# EAGLE design HbSizeMCircuit (EAGLE 8.7.0)

## Sheet 1 of 7: Power Supply
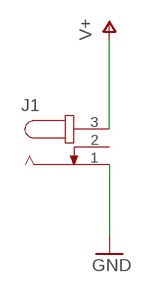
[diagram p0: schematic, sheet 1]

### Parts
J1  JACK-PLUG1  [SPC4078]

### Nets
GND: J1.1 ; also sheet 2,3,4,5,6,7
V+: J1.3 ; also sheet 3
Unconnected: J1.2

## Sheet 2 of 7: Power Switch
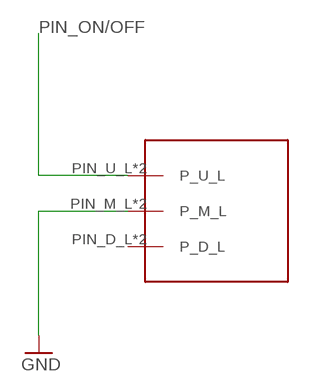
[diagram p1: schematic, sheet 2]

### Parts
U$2  IS-1250_POWERSWITCH  [IS-1250_POWERSWITCH]

### Nets
GND: U$2.PIN_M_L(P_M_L) U$2.PIN_M_R(P_M_L) ; also sheet 1,3,4,5,6,7
PIN_ON/OFF: U$2.PIN_U_L(P_U_L) U$2.PIN_U_R(P_U_L) ; also sheet 3
Unconnected: U$2.PIN_D_L(P_D_L) U$2.PIN_D_R(P_D_L)

## Sheet 3 of 7: DC-DC Converter
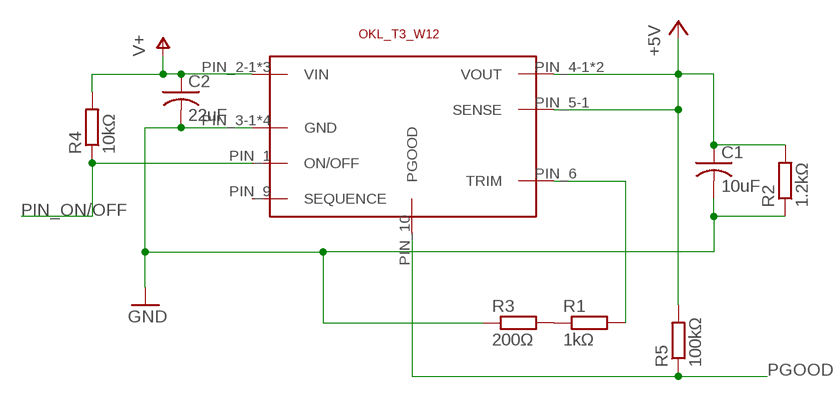
[diagram p2: schematic, sheet 3]

### Parts
C1  10uF  C-USC1206  [C1206]
C2  22uF  C-USC1206  [C1206]
R1  1kΩ  R-EU_M1206  [M1206]
R2  1.2kΩ  R-EU_M1206  [M1206]
R3  200Ω  R-EU_M1206  [M1206]
R4  10kΩ  R-EU_R1206  [R1206]
R5  100kΩ  R-EU_M1206  [M1206]
U$8  OKL_T3_W12  [OKL_T3_W12]

### Nets
+5V: C1.1 R2.2 R5.2 U$8.PIN_4-1(VOUT) U$8.PIN_4-2(VOUT) U$8.PIN_5-1(SENSE) ; also sheet 5,6,7
GND: C1.2 C2.2 R2.1 R3.1 U$8.PIN_3-1(GND) U$8.PIN_3-2(GND) U$8.PIN_3-3(GND) U$8.PIN_7(GND) ; also sheet 1,2,4,5,6,7
N$1: R1.2 U$8.PIN_6(TRIM)
N$2: R1.1 R3.2
PGOOD: R5.1 U$8.PIN_10(PGOOD) ; also sheet 6
PIN_ON/OFF: R4.1 U$8.PIN_1(ON/OFF) ; also sheet 2
V+: C2.1 R4.2 U$8.PIN_2-1(VIN) U$8.PIN_2-2(VIN) U$8.PIN_2-3(VIN) ; also sheet 1
Unconnected: U$8.PIN_9(SEQUENCE)

## Sheet 4 of 7: Buttons
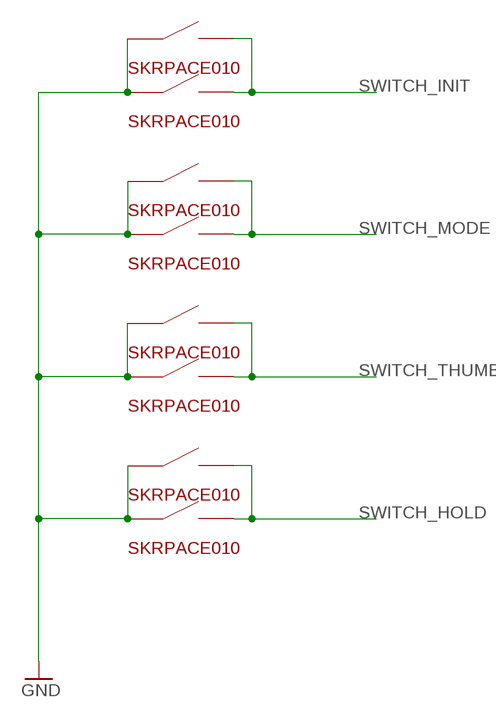
[diagram p3: schematic, sheet 4]

### Parts
U$1  SKRPACE010  [SKRPACE010]
U$3  SKRPACE010  [SKRPACE010]
U$4  SKRPACE010  [SKRPACE010]
U$5  SKRPACE010  [SKRPACE010]
U$12  SKRPACE010  [SKRPACE010]
U$13  SKRPACE010  [SKRPACE010]
U$14  SKRPACE010  [SKRPACE010]
U$15  SKRPACE010  [SKRPACE010]

### Nets
GND: U$1.PINA_LEFT(A_LEFT) U$1.PINA_RIGHT(A_LEFT) U$3.PINA_LEFT(A_LEFT) U$3.PINA_RIGHT(A_LEFT) U$4.PINA_LEFT(A_LEFT) U$4.PINA_RIGHT(A_LEFT) U$5.PINA_LEFT(A_LEFT) U$5.PINA_RIGHT(A_LEFT) U$12.PINA_LEFT(A_LEFT) U$12.PINA_RIGHT(A_LEFT) U$13.PINA_LEFT(A_LEFT) U$13.PINA_RIGHT(A_LEFT) U$14.PINA_LEFT(A_LEFT) U$14.PINA_RIGHT(A_LEFT) U$15.PINA_LEFT(A_LEFT) U$15.PINA_RIGHT(A_LEFT) ; also sheet 1,2,3,5,6,7
SWITCH_HOLD: U$12.PINB_LEFT(B_LEFT) U$12.PINB_RIGHT(B_LEFT) U$15.PINB_LEFT(B_LEFT) U$15.PINB_RIGHT(B_LEFT) ; also sheet 6
SWITCH_INIT: U$1.PINB_LEFT(B_LEFT) U$1.PINB_RIGHT(B_LEFT) U$5.PINB_LEFT(B_LEFT) U$5.PINB_RIGHT(B_LEFT) ; also sheet 6
SWITCH_MODE: U$3.PINB_LEFT(B_LEFT) U$3.PINB_RIGHT(B_LEFT) U$13.PINB_LEFT(B_LEFT) U$13.PINB_RIGHT(B_LEFT) ; also sheet 6
SWITCH_THUMB: U$4.PINB_LEFT(B_LEFT) U$4.PINB_RIGHT(B_LEFT) U$14.PINB_LEFT(B_LEFT) U$14.PINB_RIGHT(B_LEFT) ; also sheet 6

## Sheet 5 of 7: ServoMotor
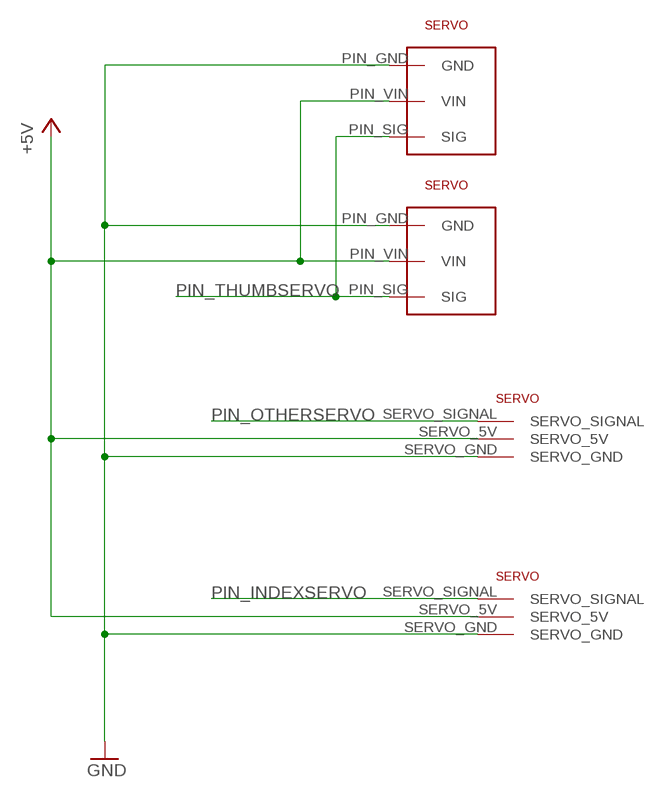
[diagram p4: schematic, sheet 5]

### Parts
U$7  NN_SERVO  [NN_SERVO]
U$9  53398-0371  [53398-0371]
U$11  NN_SERVO  [NN_SERVO]
U$16  53398-0371  [53398-0371]

### Nets
+5V: U$7.SERVO_5V U$9.PIN_VIN(VIN) U$11.SERVO_5V U$16.PIN_VIN(VIN) ; also sheet 3,6,7
GND: U$7.SERVO_GND U$9.PIN_GND(GND) U$11.SERVO_GND U$16.PIN_GND(GND) ; also sheet 1,2,3,4,6,7
PIN_INDEXSERVO: U$11.SERVO_SIGNAL ; also sheet 6
PIN_OTHERSERVO: U$7.SERVO_SIGNAL ; also sheet 6
PIN_THUMBSERVO: U$9.PIN_SIG(SIG) U$16.PIN_SIG(SIG) ; also sheet 6

## Sheet 6 of 7: CPU
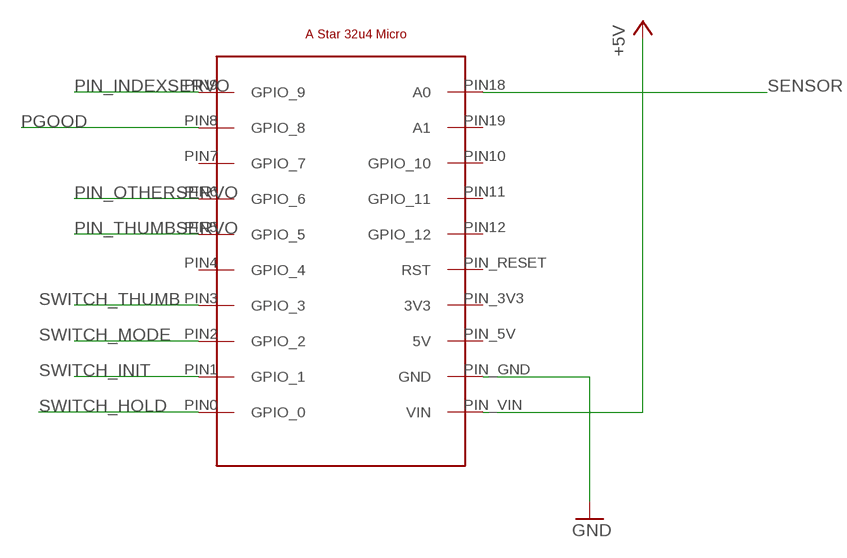
[diagram p5: schematic, sheet 6]

### Parts
U$6  POLOLU_A_STAR_32U4_MICRO_SMD  [POLOLU_A_STAR_32U4_MICRO_SMD]

### Nets
+5V: U$6.PIN_VIN(VIN) ; also sheet 3,5,7
GND: U$6.PIN_GND(GND) ; also sheet 1,2,3,4,5,7
PGOOD: U$6.PIN8(GPIO_8) ; also sheet 3
PIN_INDEXSERVO: U$6.PIN9(GPIO_9) ; also sheet 5
PIN_OTHERSERVO: U$6.PIN6(GPIO_6) ; also sheet 5
PIN_THUMBSERVO: U$6.PIN5(GPIO_5) ; also sheet 5
SENSOR: U$6.PIN18(A0) ; also sheet 7
SWITCH_HOLD: U$6.PIN0(GPIO_0) ; also sheet 4
SWITCH_INIT: U$6.PIN1(GPIO_1) ; also sheet 4
SWITCH_MODE: U$6.PIN2(GPIO_2) ; also sheet 4
SWITCH_THUMB: U$6.PIN3(GPIO_3) ; also sheet 4
Unconnected: U$6.PIN4(GPIO_4) U$6.PIN7(GPIO_7) U$6.PIN10(GPIO_10) U$6.PIN11(GPIO_11) U$6.PIN12(GPIO_12) U$6.PIN19(A1) U$6.PIN_3V3(3V3) U$6.PIN_5V(5V) U$6.PIN_RESET(RST)

## Sheet 7 of 7: Sensor
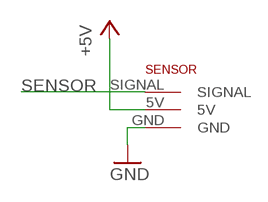
[diagram p6: schematic, sheet 7]

### Parts
U$10  NN_SENSOR  [NN_SENSOR]

### Nets
+5V: U$10.5V ; also sheet 3,5,6
GND: U$10.GND ; also sheet 1,2,3,4,5,6
SENSOR: U$10.SIGNAL ; also sheet 6

## Library data of the parts
C1 C2 = resistor:C-US: CAPACITOR, American symbol
J1 = HbSizeM:JACK-PLUG: DC POWER JACK Power Jack, DC, Right Angle, Through Hole, Rated 5A at 16VDC, PC Terminals Distributor: Farnell (www.Farnell.de) Drawing: 84N1161.pdf / 84N1162.pdf Manufacturer: SPC Technology (www.spctechnology.com) Type: SPC4077 / SPC 4078
R1-R5 = resistor:R-EU_: RESISTOR, European symbol
U$1 U$3-U$5 U$12-U$15 = HbSizeM:SKRPACE010
U$2 = HbHandBoard_SizeS:IS-1250_POWERSWITCH
U$6 = HbHandBoard_SizeS:POLOLU_A_STAR_32U4_MICRO_SMD
U$7 U$11 = HbSizeM:NN_SERVO
U$8 = HbHandBoard_SizeS:OKL_T3_W12
U$9 U$16 = HbHandBoard_SizeS:53398-0371
U$10 = HbSizeM:NN_SENSOR

## Board
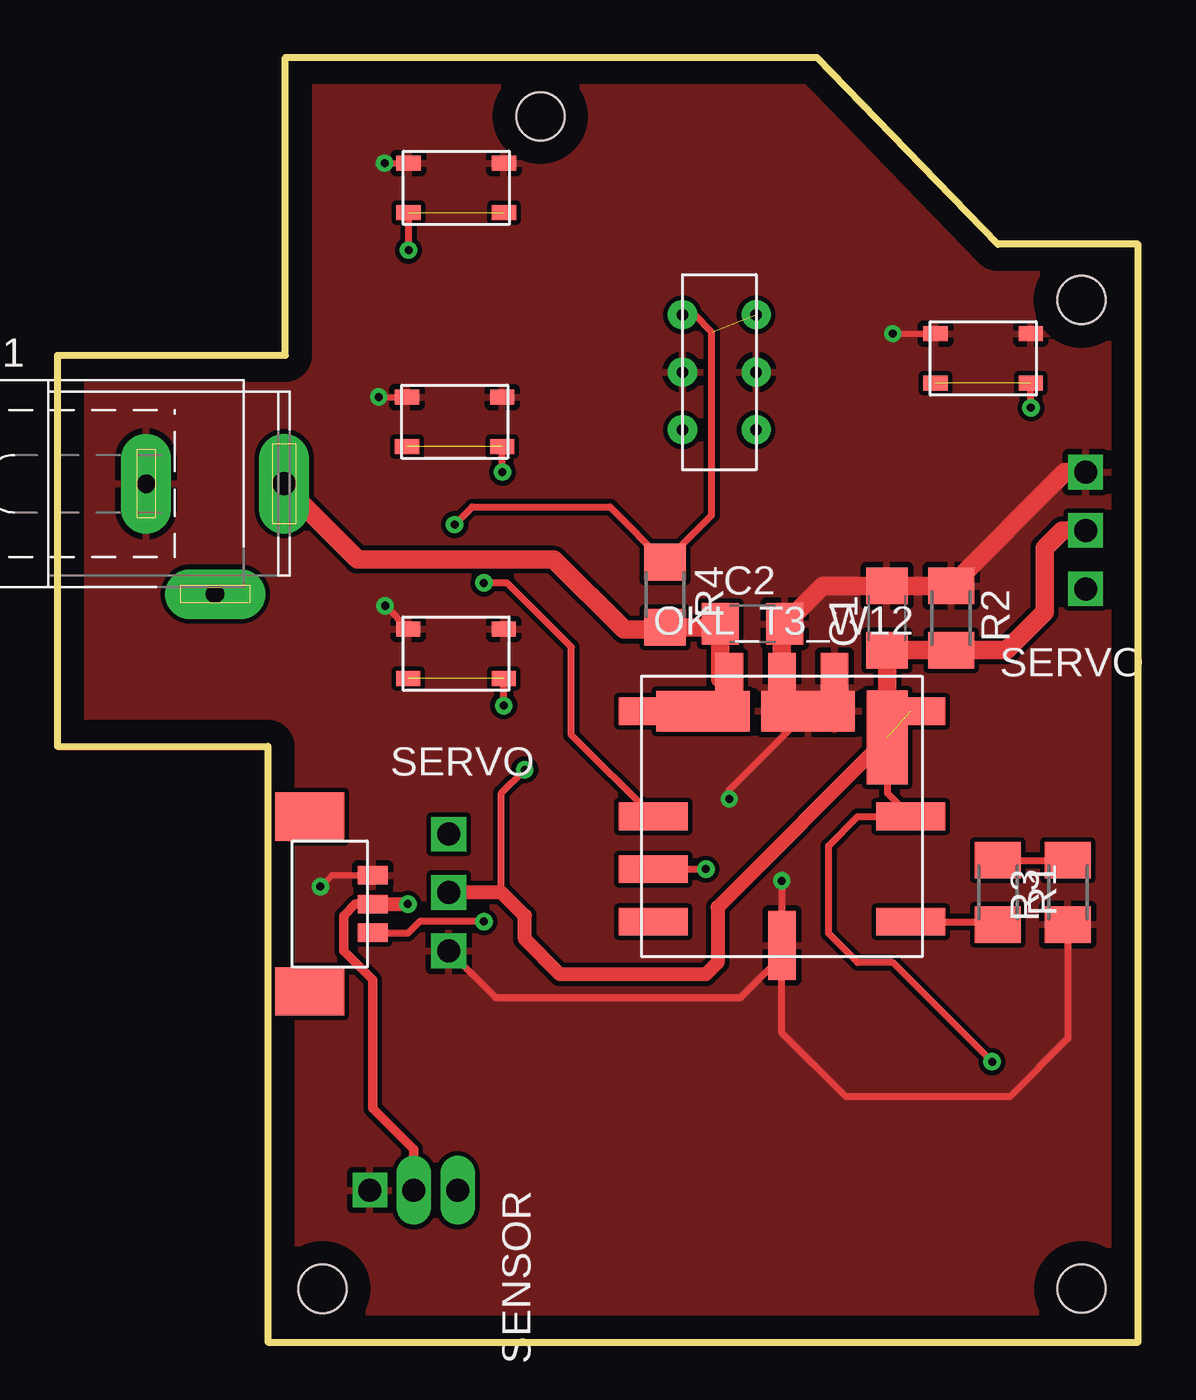
[diagram p7: board, top side]
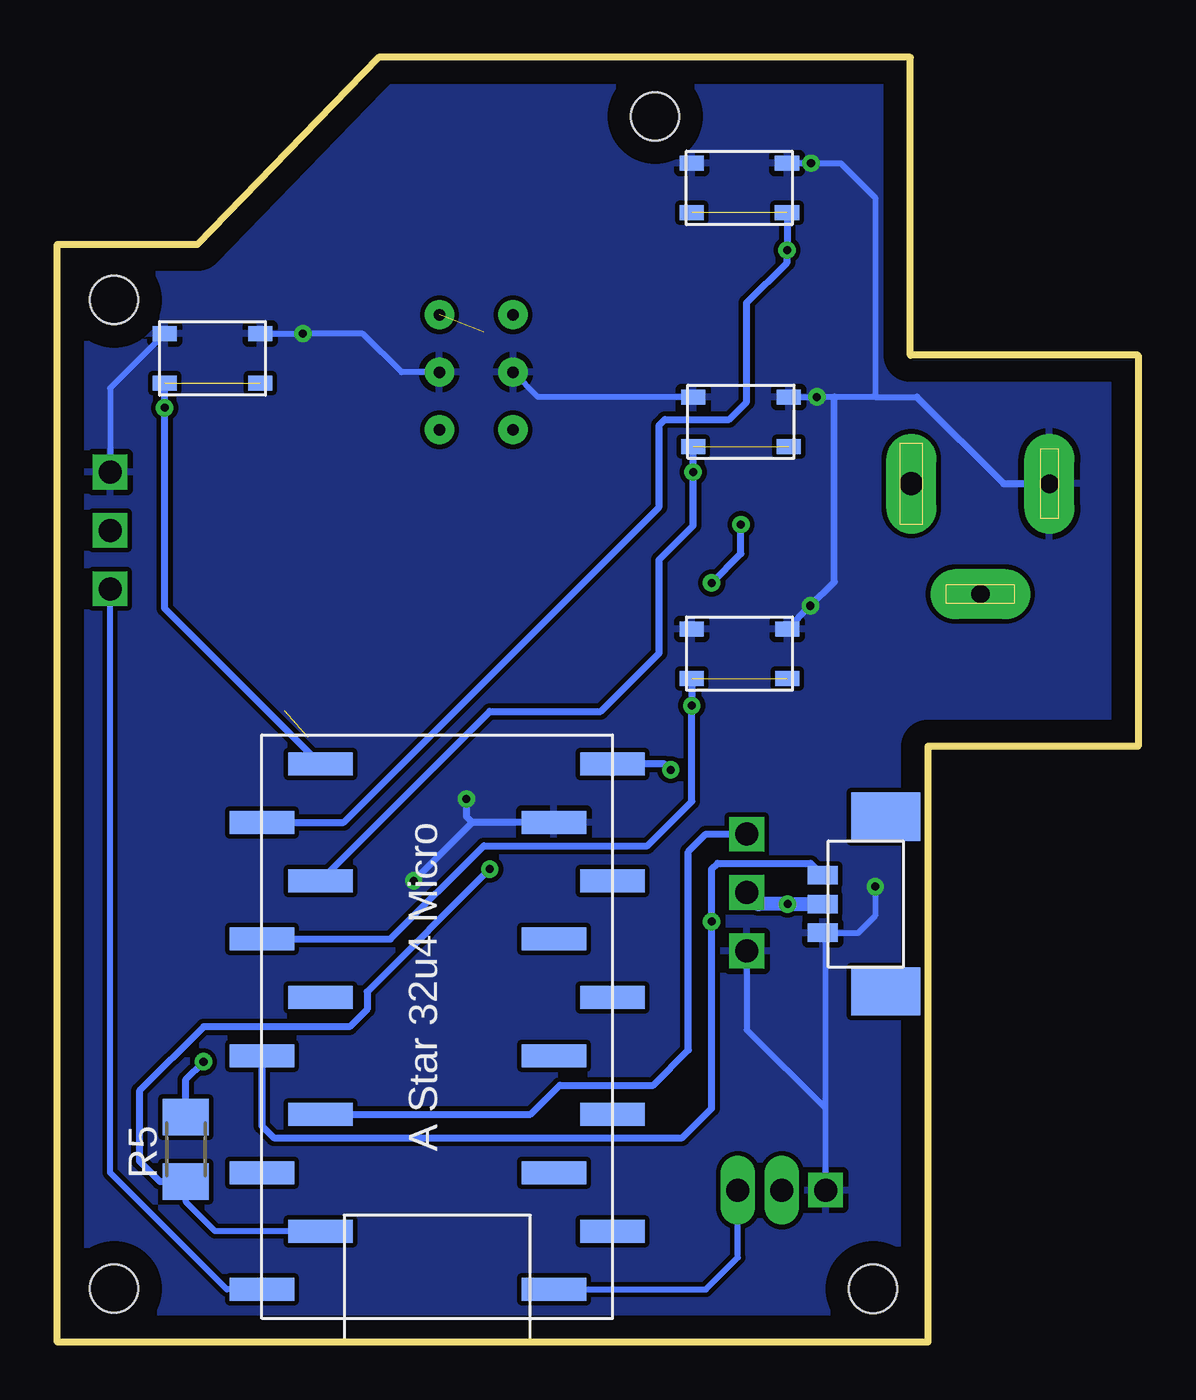
[diagram p8: board, bottom side, seen from below]

Size 46.99 x 55.88 mm. Coordinates in mm from the lower left corner, seen from the top.
Outline: 0,42.93 9.91,42.93 9.91,55.88 33.02,55.88 40.89,47.75 46.99,47.75 46.99,0 9.14,0 9.14,25.91 0,25.91 0,42.93
Copper layers (1*16): Top 0.035mm / dielectric 1.5mm / Bottom 0.035mm
Design rules "default *": minimum track width 6mil, minimum drill 0.35mm, track to track 8mil, track to pad 8mil, pad to pad 8mil, via to via 8mil, smd to smd 8mil, copper to edge 40mil, drill to drill 6mil, minimum pad ring 10mil, minimum via ring 8mil, stop-mask expansion 4mil, vias tented up to drill 0mil, thermal gap 10mil
Holes 2.1 mm at 21,53.32 44.53,45.33 44.53,2.32 11.52,2.32

### Footprints (pad centres in the part's own frame; a part is rotated, then mirrored left to right if it is on the bottom)
C1206 = smd 1.6 x 1.8: 1 -1.4,0; 2 1.4,0
SPC4078 = drill 0.8 pad 2.184 long: 1 -3,0; 2 0,-4.8 | drill 1 pad 2.184 long: 3 3,0
M1206 = smd 1.6 x 2: 1 -1.4,0; 2 1.4,0
R1206 = smd 1.6 x 1.803: 1 -1.422,0; 2 1.422,0
SKRPACE010 = smd 1.05 x 0.65: PINA_LEFT -2.075,1.075; PINA_RIGHT 2.075,1.075; PINB_LEFT -2.075,-1.075; PINB_RIGHT 2.075,-1.075
IS-1250_POWERSWITCH = drill 0.5 pad 1.27: PIN_D_L -1.6,-2.5; PIN_D_R 1.6,-2.5; PIN_M_L -1.6,0; PIN_M_R 1.6,0; PIN_U_L -1.6,2.5; PIN_U_R 1.6,2.5
POLOLU_A_STAR_32U4_MICRO_SMD = smd 2.801 x 1: PIN0 5.08,-11.43; PIN1 7.62,-8.89; PIN2 5.08,-6.35; PIN3 7.62,-3.81; PIN4 5.08,-1.27; PIN5 7.62,1.27; PIN6 5.08,3.81; PIN7 7.62,6.35; PIN8 5.08,8.89; PIN9 7.62,11.43; PIN10 -5.08,6.35; PIN11 -7.62,3.81; PIN12 -5.08,1.27; PIN18 -5.08,11.43; PIN19 -7.62,8.89; PIN_3V3 -5.08,-3.81; PIN_5V -7.62,-6.35; PIN_GND -5.08,-8.89; PIN_RESET -7.62,-1.27; PIN_VIN -7.62,-11.43
NN_SERVO = drill 1 square: SERVO_5V 0,0; SERVO_GND 0,-2.54; SERVO_SIGNAL 0,2.54
OKL_T3_W12 = smd 3 x 1.2: PIN_1 0.5,6.1; PIN_2-1 0.5,10.68; PIN_4-1 11.7,10.68; PIN_5-1 11.7,6.1; PIN_6 11.7,1.52; PIN_9 0.5,1.52; PIN_10 0.5,3.81 | smd 4.07 x 1.77: PIN_2-2 2.665,10.68; PIN_3-2 7.245,10.68 | smd 1.2 x 3: PIN_2-3 3.81,11.7; PIN_3-1 6.1,11.7; PIN_3-3 8.39,11.7; PIN_7 6.1,0.5 | smd 1.77 x 4.07: PIN_4-2 10.685,9.535
53398-0371 = smd 2.1 x 3: P$4 3.8,-2.75; P$5 -3.8,-2.75 | smd 0.8 x 1.3: PIN_GND -1.25,0; PIN_SIG 1.25,0; PIN_VIN 0,0
NN_SENSOR = drill 1 long: 5V 0,0; SIGNAL 0,1.905 | drill 1 square: GND 0,-1.905

### Placement (x,y rotation side)
C1  36.07,31.5 90 top
C2  30.23,31.24 0 top
J1  6.86,37.34 0 top
R1  40.89,19.56 270 top
R2  38.86,31.5 270 top
R3  43.94,19.56 90 top
R4  26.42,32.51 270 top
R5  41.4,8.38 90 bottom
U$1  17.34,50.21 0 bottom
U$2  28.78,42.19 0 top
U$3  17.27,40.04 0 top
U$4  17.33,29.94 0 top
U$5  17.34,50.21 0 top
U$6  30.48,13.72 180 bottom
U$7  17.02,19.56 0 top
U$8  25.4,16.76 0 top
U$9  13.72,19.05 90 bottom
U$10  15.49,6.6 270 top
U$11  44.7,35.31 180 top
U$12  40.25,42.79 0 top
U$13  17.27,40.04 0 bottom
U$14  17.33,29.94 0 bottom
U$15  40.25,42.79 0 bottom
U$16  13.72,19.05 270 top

### Tracks (layer width: path | path; a pad name or v marks a point on that pad's centre or on a via)
+5V  (via drill 0.35)  (1 unrouted)
  Top 0.305: 19.3,19.56 19.3,23.88 v20.32,24.89 | v40.64,12.19 36.32,16.51 34.8,16.51 33.53,17.78 33.53,21.59 34.8,22.86 U$8.PIN_5-1 36.09,23.88 U$8.PIN_4-2
  Top 0.406: U$16.PIN_VIN 12.95,19.05 12.45,18.54 12.45,17.02 13.72,15.75 13.72,10.16 15.49,8.38 U$10.5V
  Top 0.61: U$16.PIN_VIN v15.24,19.05 | U$8.PIN_4-2 28.7,18.92 28.7,16.51 28.19,16 21.84,16 20.32,17.53 20.32,18.54 19.3,19.56 U$7.SERVO_5V
  Top 0.813: U$8.PIN_4-2 36.09,30.08 C1.1 R2.2 41.27,30.1 42.93,31.75 42.93,34.54 43.69,35.31 U$11.SERVO_5V
  Bottom 0.305: v20.32,24.89 20.57,25.15 U$6.PIN_VIN | R5.2 41.4,11.43 v40.64,12.19
  Bottom 0.61: U$7.SERVO_5V 16.51,19.05 v15.24,19.05 U$16.PIN_VIN
GND  (via drill 0.35)
  Top 0.254: v36.32,43.87 U$15.PINA_RIGHT | v14.22,51.28 U$1.PINA_RIGHT U$5.PINA_LEFT | v13.97,41.11 U$13.PINA_RIGHT | U$13.PINA_RIGHT | U$16.PIN_GND 11.92,20.3 v11.43,19.81
  Top 0.305: U$7.SERVO_GND 19.05,14.99 29.72,14.99 31.5,16.77 | 31.5,16.77 U$8.PIN_7 v31.5,20.06 v31.5,20.07 | v14.25,32.03 U$14.PINA_RIGHT | U$8.PIN_3-2 29.21,24.01 v29.21,23.62 | U$8.PIN_3-1 32.52,27.44 U$8.PIN_3-2 | U$8.PIN_3-2 33.66,28.46 U$8.PIN_3-3 | R3.1 43.94,13.21 41.4,10.67 34.29,10.67 31.5,13.46 31.5,16.77
  Top 0.813: U$8.PIN_3-1 31.5,31.12 C2.2 33.28,32.9 C1.2 R2.1 43.81,37.85 U$11.SERVO_GND
  Bottom 0.254: 11.43,41.11 9.61,41.11 | 11.43,41.11 13.21,41.11 v13.97,41.11 U$13.PINA_RIGHT | 11.43,41.11 11.43,49.78 12.93,51.28 v14.22,51.28 U$1.PINA_RIGHT | U$13.PINA_LEFT 26.1,41.11 U$2.PIN_M_L | U$2.PIN_M_R 32.03,42.19 33.71,43.87 v36.32,43.87 U$15.PINA_RIGHT | U$15.PINA_LEFT 44.7,41.49 U$11.SERVO_GND | U$10.GND 13.59,10.16 | 13.59,10.16 13.59,17.67 U$9.PIN_GND 13.7,17.78 12.19,17.78 11.43,18.54 v11.43,19.81 | U$7.SERVO_GND 17.02,13.59 13.59,10.16
  Bottom 0.305: U$6.PIN_GND 28.96,22.61 | 28.96,22.61 v31.5,20.07 | U$14.PINA_RIGHT v14.25,32.03 13.21,33.07 13.21,41.11 | v29.21,23.62 29.21,22.86 28.96,22.61 | 9.61,41.11 5.84,37.34 J1.1
  pour Top: 0,42.93 9.91,42.93 9.91,55.88 33.02,55.88 40.89,47.75 46.99,47.75 46.99,0 9.14,0 9.14,25.91 0,25.91
  pour Bottom: 0,42.93 0,25.91 9.14,25.91 9.14,0 46.99,0 46.99,47.75 40.89,47.75 33.02,55.88 9.91,55.88 9.91,42.93
N$1
  Top 0.305: U$8.PIN_6 40.77,18.28 R1.2
N$2
  Top 0.305: R1.1 R3.2
PGOOD  (via drill 0.35)
  Top 0.305: U$8.PIN_10 v28.19,20.57
  Bottom 0.254: U$6.PIN8 40.13,4.83 41.4,6.1 R5.1
  Bottom 0.305: v28.19,20.57 33.53,15.24 33.53,14.48 34.29,13.72 40.64,13.72 43.43,10.92 43.43,7.87 42.54,6.98 R5.1
PIN_INDEXSERVO
  Bottom 0.254: U$6.PIN9 39.62,2.29 44.7,7.37 U$11.SERVO_SIGNAL
PIN_ON/OFF  (via drill 0.35)  (1 unrouted)
  Top 0.305: U$2.PIN_U_L 27.7,44.69 28.45,43.94 28.45,35.97 R4.1 24.03,36.32 18.03,36.32 v17.27,35.56 | U$8.PIN_1 22.35,26.41 22.35,30.23 19.56,33.02 v18.54,33.02
  Bottom 0.305: v18.54,33.02 17.27,34.29 v17.27,35.56
PIN_OTHERSERVO
  Bottom 0.305: U$6.PIN6 26.42,9.91 25.15,11.18 21.08,11.18 19.56,12.7 19.56,21.34 18.8,22.1 U$7.SERVO_SIGNAL
PIN_THUMBSERVO  (via drill 0.35)
  Top 0.305: v18.54,18.29 15.75,18.29 15.24,17.78 13.74,17.78 U$16.PIN_SIG
  Bottom 0.305: U$6.PIN5 38.1,9.4 37.59,8.89 19.81,8.89 18.54,10.16 v18.54,18.29 18.54,20.57 18.29,20.83 14.24,20.83 U$9.PIN_SIG
SENSOR
  Bottom 0.254: U$6.PIN18 18.8,2.29 17.4,3.68 U$10.SIGNAL
SWITCH_HOLD  (via drill 0.35)  (2 unrouted)
  Top 0.305: v42.33,40.64 U$12.PINB_RIGHT | U$12.PINB_RIGHT
  Bottom 0.305: U$6.PIN0 42.33,31.91 v42.33,40.64 U$12.PINB_RIGHT
SWITCH_INIT  (via drill 0.35)  (2 unrouted)
  Top 0.305: v15.27,47.5 U$5.PINB_LEFT | U$5.PINB_LEFT
  Bottom 0.305: U$6.PIN1 34.54,22.61 20.83,36.32 20.83,39.88 20.57,40.13 17.78,40.13 17.02,40.89 17.02,45.21 15.27,46.96 v15.27,47.5 U$5.PINB_LEFT
SWITCH_MODE  (via drill 0.35)  (2 unrouted)
  Top 0.305: v19.35,37.85 U$3.PINB_RIGHT
  Bottom 0.305: U$6.PIN2 28.19,27.43 23.37,27.43 20.83,29.97 20.83,34.04 19.35,35.52 v19.35,37.85 U$3.PINB_RIGHT
SWITCH_THUMB  (via drill 0.35)  (2 unrouted)
  Top 0.305: v19.41,27.69 U$4.PINB_RIGHT
  Bottom 0.305: U$6.PIN3 32.51,17.53 28.45,21.59 21.34,21.59 19.41,23.52 v19.41,27.69 U$4.PINB_RIGHT
V+
  Top 0.305: U$8.PIN_2-3 28.19,27.44 U$8.PIN_2-2 U$8.PIN_2-1
  Top 0.813: U$8.PIN_2-3 28.83,28.85 C2.1 28.67,31.09 R4.2 26.31,30.99 24.64,30.99 21.59,34.04 13.05,34.04 9.86,37.23 J1.3